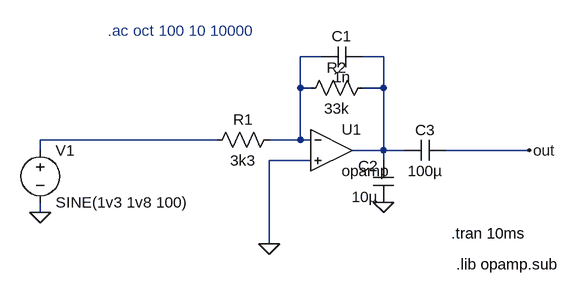
[diagram p0: schematic outputAudioSchematic.asc]
outputAudioSchematic.asc, the LTspice schematic file:
Version 4
SHEET 1 952 688
WIRE 464 176 432 176
WIRE 560 176 528 176
WIRE 432 224 432 176
WIRE 448 224 432 224
WIRE 560 224 560 176
WIRE 560 224 528 224
WIRE 304 304 32 304
WIRE 432 304 432 224
WIRE 432 304 384 304
WIRE 448 304 432 304
WIRE 32 320 32 304
WIRE 560 320 560 224
WIRE 560 320 512 320
WIRE 592 320 560 320
WIRE 784 320 656 320
WIRE 448 336 384 336
WIRE 560 336 560 320
WIRE 32 416 32 400
WIRE 384 464 384 336
FLAG 32 416 0
FLAG 384 464 0
FLAG 784 320 out
FLAG 560 400 0
SYMBOL voltage 32 304 R0
SYMATTR InstName V1
SYMATTR Value SINE(1v3 1v8 100)
SYMBOL res 400 288 R90
WINDOW 0 0 56 VBottom 2
WINDOW 3 32 56 VTop 2
SYMATTR InstName R1
SYMATTR Value 3k3
SYMBOL res 544 208 R90
WINDOW 0 0 56 VBottom 2
WINDOW 3 32 56 VTop 2
SYMATTR InstName R2
SYMATTR Value 33k
SYMBOL Opamps/opamp 480 256 R0
SYMATTR InstName U1
SYMBOL cap 528 160 R90
WINDOW 0 0 32 VBottom 2
WINDOW 3 32 32 VTop 2
SYMATTR InstName C1
SYMATTR Value 1n
SYMBOL cap 576 400 R180
WINDOW 0 24 56 Left 2
WINDOW 3 24 8 Left 2
SYMATTR InstName C2
SYMATTR Value 10µ
SYMBOL cap 656 304 R90
WINDOW 0 0 32 VBottom 2
WINDOW 3 32 32 VTop 2
SYMATTR InstName C3
SYMATTR Value 100µ
TEXT 664 448 Left 2 !.tran 10ms
TEXT 672 496 Left 2 !.lib opamp.sub
TEXT 136 136 Left 2 ;.ac oct 100 10 10000

The netlist it stands for:
* outputAudioSchematic.asc
V1 N003 0 SINE(1v3 1v8 100)
R1 N001 N003 3k3
R2 N002 N001 33k
XU1 N001 0 N002 opamp Aol=100K GBW=10Meg  ; pins invin noninvin out
C1 N002 N001 1n
C2 0 N002 10µ
C3 out N002 100µ
.tran 10ms
.lib opamp.sub
* .ac oct 100 10 10000
.backanno
.end